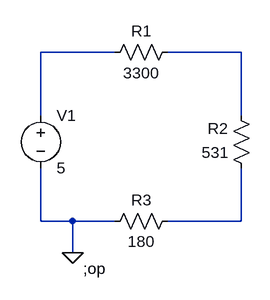
[diagram p0: schematic Practica 2-3.asc]
Practica 2-3.asc, the LTspice schematic file:
Version 4
SHEET 1 880 680
WIRE 176 0 64 0
WIRE 368 0 256 0
WIRE 64 96 64 0
WIRE 368 96 368 0
WIRE 64 256 64 176
WIRE 112 256 64 256
WIRE 176 256 112 256
WIRE 368 256 368 176
WIRE 368 256 256 256
WIRE 112 304 112 256
FLAG 112 304 0
SYMBOL voltage 64 80 R0
WINDOW 123 0 0 Left 0
WINDOW 39 0 0 Left 0
SYMATTR InstName V1
SYMATTR Value 5
SYMBOL res 272 -16 R90
WINDOW 0 0 56 VBottom 2
WINDOW 3 32 56 VTop 2
SYMATTR InstName R1
SYMATTR Value 3300
SYMBOL res 384 192 R180
WINDOW 0 36 76 Left 2
WINDOW 3 36 40 Left 2
SYMATTR InstName R2
SYMATTR Value 531
SYMBOL res 160 272 R270
WINDOW 0 32 56 VTop 2
WINDOW 3 0 56 VBottom 2
SYMATTR InstName R3
SYMATTR Value 180
TEXT 128 328 Left 2 !;op

The netlist it stands for:
* Practica 2-3.asc
V1 N001 0 5
R1 N002 N001 3300
R2 N003 N002 531
R3 0 N003 180
;op
.backanno
.end